# Altium schematic sheet Instrumentation amplifier.SchDoc
size A4; SheetNumber: 3; SheetTotal: 7
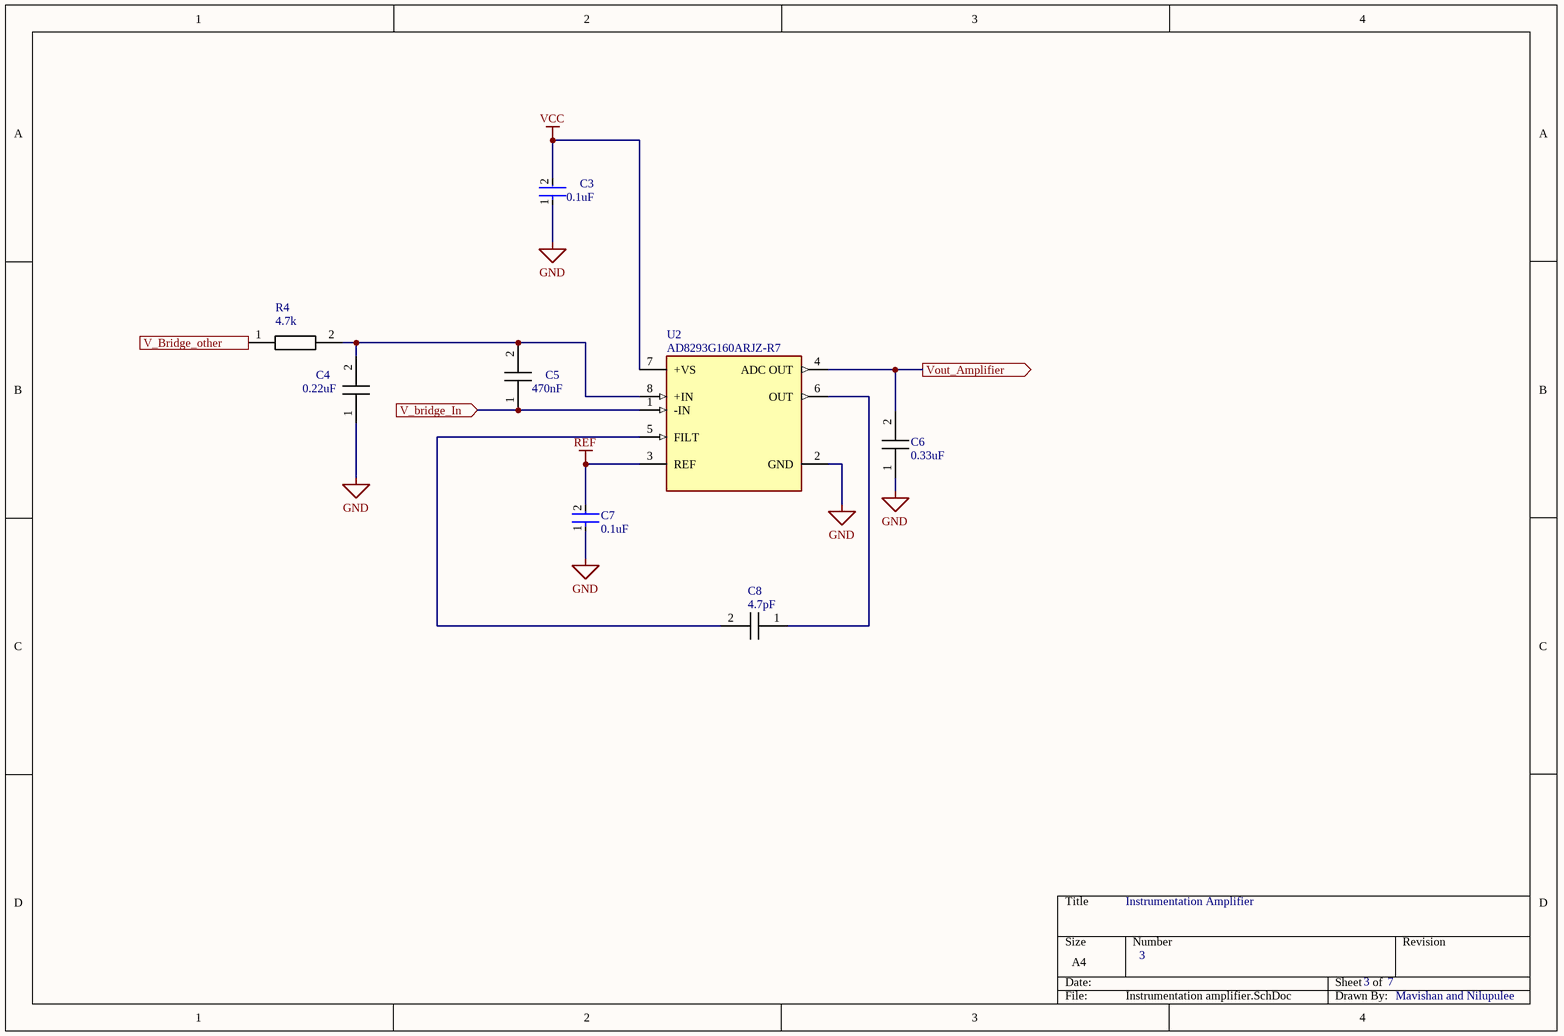
[diagram p0: Instrumentation amplifier.SchDoc]

## Parts
C3  0.1uF  [FP-C1206C-EB-MFG]
C4  Parameter 1: 0.22uF  [CAPC3216X94N]  (hidden comment: 12063C224JAT2A)
C5  Parameter 1: 470nF  [CAPC3216X152N]  (hidden comment: 12065C474JAT2A)
C6  Parameter 1: 0.33uF  [CAPC3216X127N]  (hidden comment: 12063C334MAT2A)
C7  0.1uF  [FP-C1206C-EB-MFG]
C8  Parameter 1: 4.7pF  [CAPC3216X94N]  (hidden comment: 12063A4R7DAT2A)
R4  Parameter 1: 4.7k  [RESC3116X65N]  (hidden comment: CHP1206AFX-4701ELF)
U2  AD8293G160ARJZ-R7  [FP-RJ-8-IPC_B]

## Ports
V_bridge_In (in, see Main PCB[2B]), V_Bridge_other (in, see Main PCB[2B]), Vout_Amplifier (out, see Main PCB[2B])

## Nets
GND: C3.1 C4.1(C1) C6.1(C1) C7.1 U2.2(GND)
REF: C7.2 U2.3(REF)
VCC: C3.2 U2.7(+VS)
V_bridge_In: C5.1 U2.1(-IN) ; port V_bridge_In
V_Bridge_other: R4.1 ; port V_Bridge_other
Vout_Amplifier: C6.2(C2) U2.4(ADC_OUT) ; port Vout_Amplifier
NetC4_2: C4.2(C2) C5.2 R4.2 U2.8(+IN)
NetC8_1: C8.1 U2.6(OUT)
NetC8_2: C8.2 U2.5(FILT)

## Notes on the sheet
- Instrumentation Amplifier
- 3
- 7
- Mavishan and Nilupulee

## Library data of the parts
C3 C7 = CMP-1037-04186-2: CAP CER 0.1UF 25V C0G/NP0 1206; Manufacturer: KEMET; Manufacturer Part Number: C1206C104F3GACTU; Material: Ceramic; Value: 0.10 μF; Temperature Characteristic: C0G; Temperature Coefficient: 15%; Tolerance: 0.01; Automotive Grade: Grade 0; Device Class L3: Ceramic Capacitors; Voltage Rating: 25 V; Temperature Range Low: -55°C; RoHS: TRUE; Package: C1206C-EB; Category: Cap; Lead Free: Yes; ComponentLink2URL: https://content.kemet.com/datasheets/KEM_C1007_X8R_ULTRA_150C_SMD.pdf; Ipc Land Pattern Name: CAPC320160X78; Temperature Range High: +150°C; Height: 0.88mm; Digikey Description: CAP CER 0.1UF 25V C0G/NP0 1206; ComponentLink2Description: Datasheet; Capacitance: 0.10 μF; Mouser Description: Multilayer Ceramic Capacitors MLCC - SMD/SMT 25volts 0.1uF 1% C0G; Octopart: https://octopart.com/c1206c104f3gactu-kemet-13149870; Device Class L1: Passive Components; Device Class L2: Capacitors; Automotive: Yes; Temperature: -55°C to +150°C
C4 = 12063C224JAT2A: Capacitor; Manufacturer_Name: Kyocera AVX; Manufacturer_Part_Number: 12063C224JAT2A; Mouser Part Number: 581-12063C224JAT2A; Arrow Part Number: 12063C224JAT2A; Arrow Price/Stock: https://www.arrow.com/en/products/12063c224jat2a/avx
C5 = 12065C474JAT2A: Capacitor; Manufacturer_Name: Kyocera AVX; Datasheet Link: https://spicat.kyocera-avx.com/product/mlcc/chartview/12065C474JAT2A/DataSheet/X7R; Height: 1.52mm; Manufacturer_Part_Number: 12065C474JAT2A; Mouser Part Number: 581-12065C474J; Mouser Price/Stock: https://www.mouser.co.uk/ProductDetail/AVX/12065C474JAT2A?qs=JKNO%252BtokWhWmgS3PHs6ZAg%3D%3D; as: *
C6 = 12063C334MAT2A: Capacitor; Manufacturer_Name: Kyocera AVX; Manufacturer_Part_Number: 12063C334MAT2A; Mouser Part Number: 581-12063C334MAT2A; Mouser Price/Stock: https://www.mouser.co.uk/ProductDetail/AVX/12063C334MAT2A?qs=UY55afH%252BLTTA4%2F7p5aIkng%3D%3D
C8 = 12063A4R7DAT2A: Capacitor; Manufacturer_Name: Kyocera AVX; Datasheet Link: https://spicat.kyocera-avx.com/product/mlcc/chartview/12063A4R7DAT2A/DataSheet/NP0; Height: 0.94mm; Manufacturer_Part_Number: 12063A4R7DAT2A; Mouser Part Number: 581-12063A4R7DAT2A; Mouser Price/Stock: https://www.mouser.com/Search/Refine.aspx?Keyword=581-12063A4R7DAT2A
R4 = CHP1206AFX-4701ELF: Resistor; Manufacturer_Name: Bourns; Datasheet Link: https://www.mouser.be/datasheet/2/54/chp-a-1858677.pdf; Height: 0.65mm; Manufacturer_Part_Number: CHP1206AFX-4701ELF; Mouser Part Number: 652-CHP1206AFX-4701L; Mouser Price/Stock: https://www.mouser.co.uk/ProductDetail/Bourns/CHP1206AFX-4701ELF?qs=GedFDFLaBXHtzjpWW2eupA%3D%3D
U2 = CMP-09116-000116-1: IC INST AMP 1 CIRCUIT SOT23-8; Output Current per Channel: 35mA; -3db Bandwidth: 500Hz; Max Supply Voltage: 5.5V; Number of Circuits: 1; Input Resistance: 10GR; Power Supply Rejection Ratio (PSRR): 94dB; Input Offset Voltage (Vos): 50uV; Input Bias Current: 2nA; Min Supply Voltage: 1.8V; Amplifier Type: INSTRUMENTATION AMPLIFIER; Common Mode Rejection Ratio: 140dB; Max Supply Current: 1.5mA; Operating Supply Current: 1.3mA; Min Operating Temperature: -40°C; Length: 2.9mm; Packaging: Tape and Reel; Case/Package: SOT; Series: -; Height: 1.3mm; Number of Amplifiers: 1; REACH SVHC: No SVHC; Number of Elements: 1; Lead Free: Contains Lead; Gain Bandwidth Product: 500Hz; Number of Channels: 1; Number of Pins: 8; Mount: Surface Mount; Package Quantity: 3000; Width: 1.6mm; Contact Plating: Gold; RoHS Compliant: Yes; Max Operating Temperature: 85°C